# Altium schematic sheet 枪盒触摸板-20201219.SchDoc
size A3
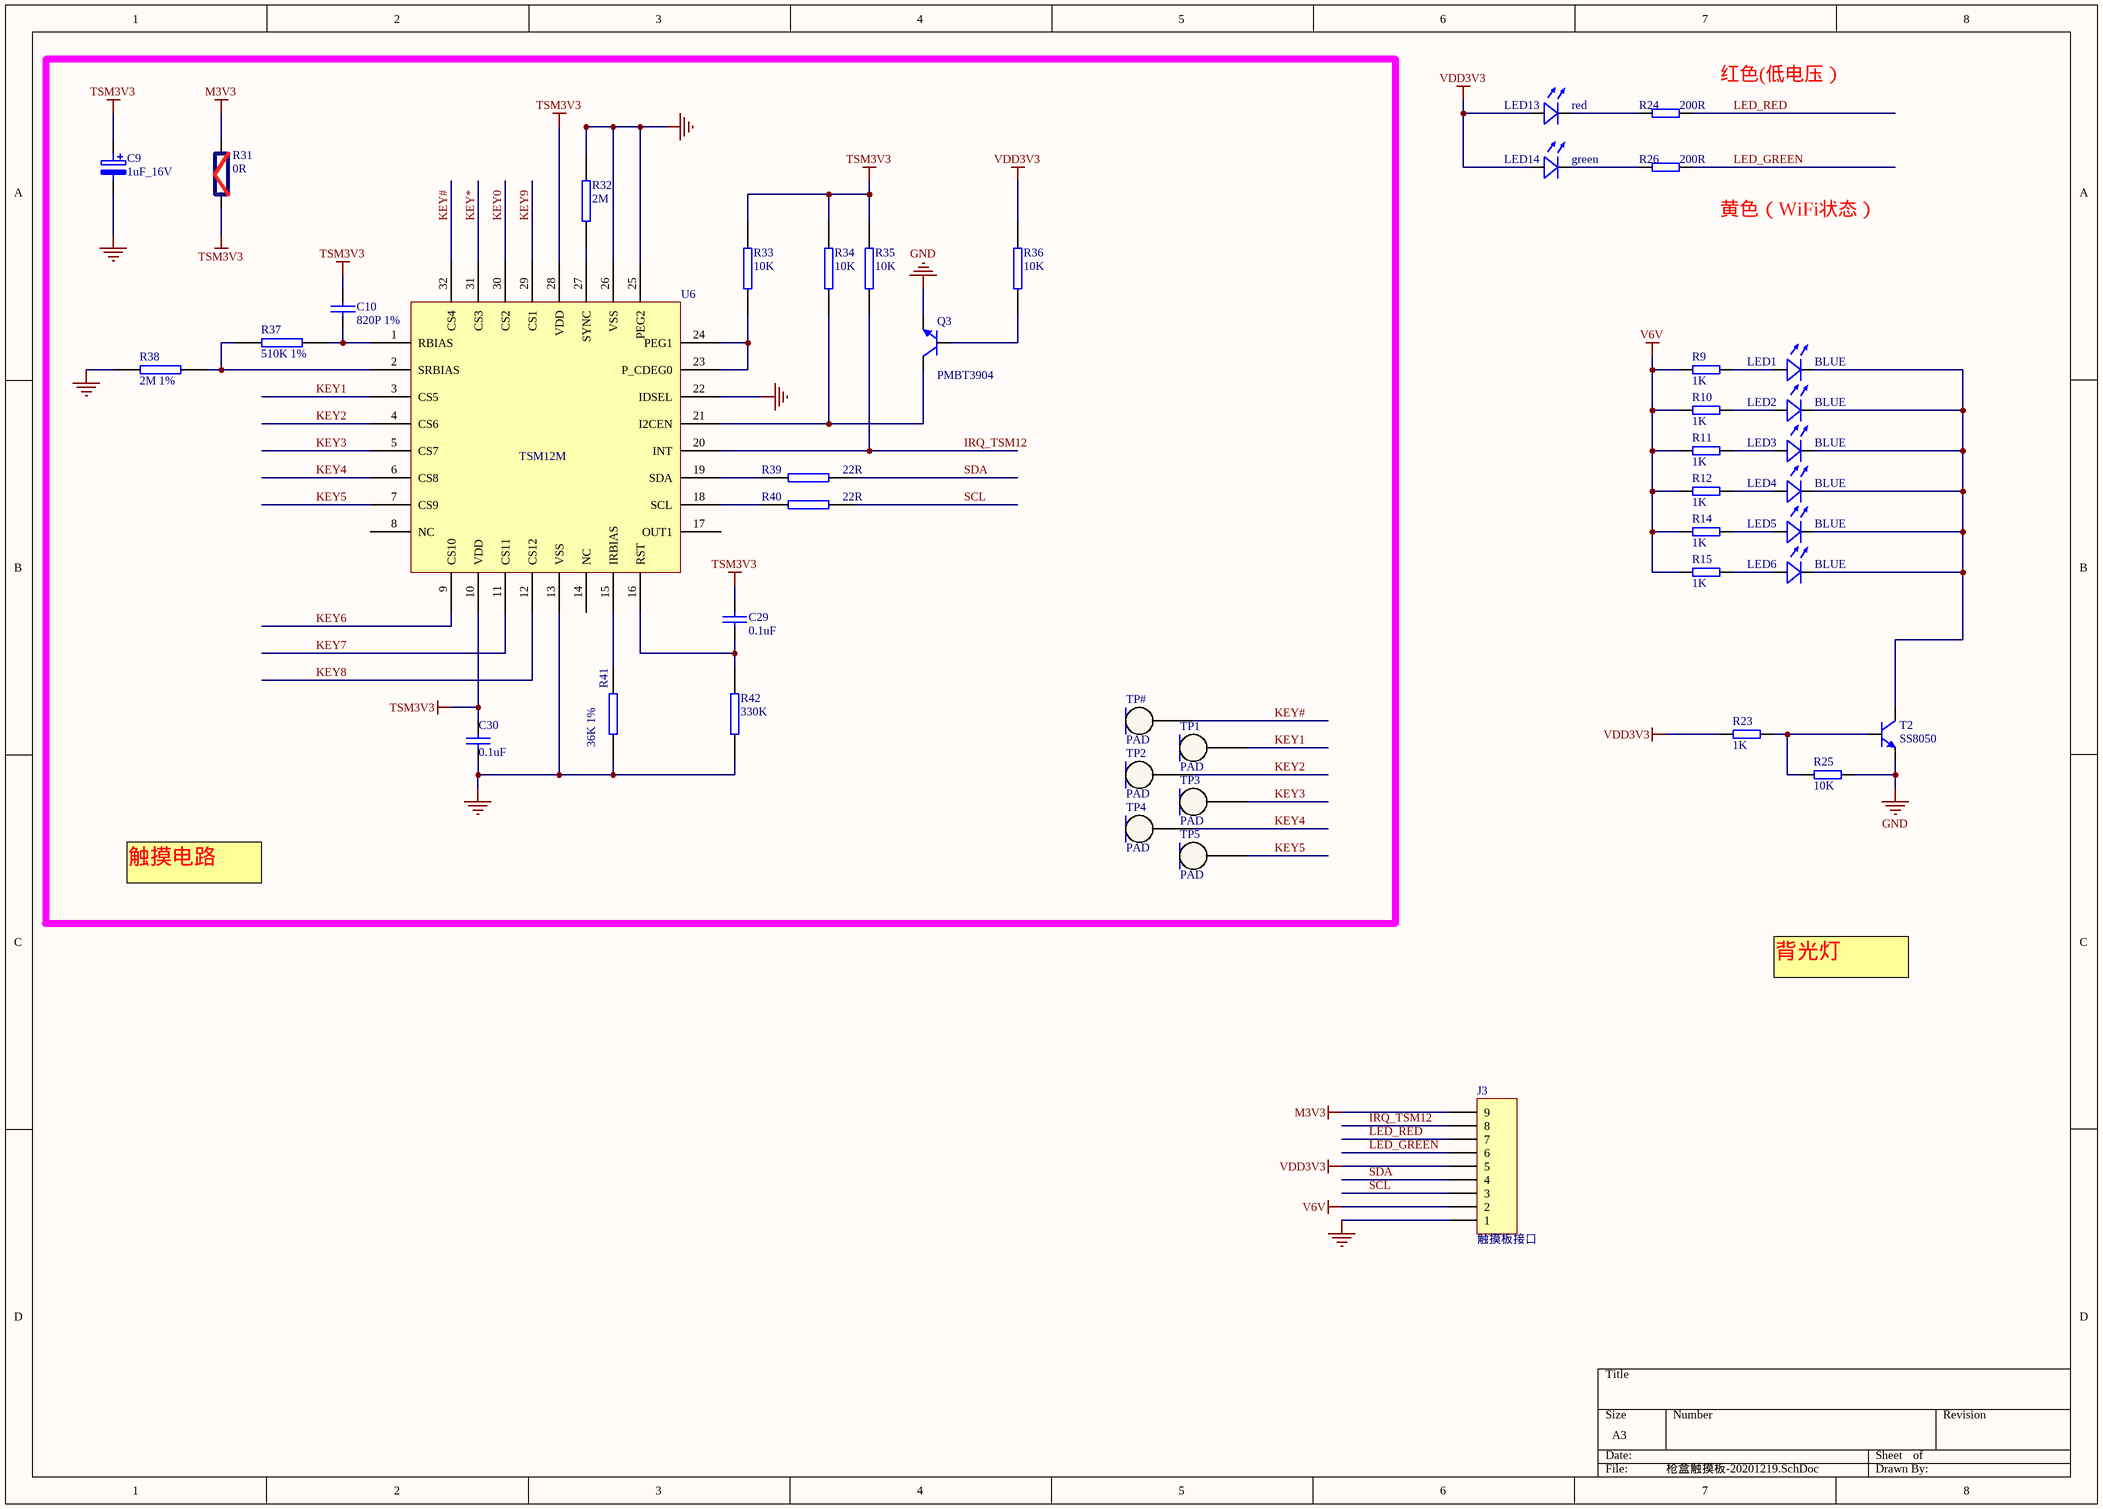
[diagram p0: 枪盒触摸板-20201219.SchDoc]

## Parts
C9  1uF_16V  [0805C]
C10  820P 1%  [0402C]
C29  0.1uF  [0402C]
C30  0.1uF  [0402C]
J3  触摸板接口  [FPC-0.5-9P]
LED1  BLUE  [0603LED]
LED2  BLUE  [0603LED]
LED3  BLUE  [0603LED]
LED4  BLUE  [0603LED]
LED5  BLUE  [0603LED]
LED6  BLUE  [0603LED]
LED13  red  [0603LED]
LED14  green  [0603LED]
Q3  PMBT3904  [SOT-23-3L]
R9  1K  [0402R]
R10  1K  [0402R]
R11  1K  [0402R]
R12  1K  [0402R]
R14  1K  [0402R]
R15  1K  [0402R]
R23  1K  [0402R]
R24  200R  [0402R]
R25  10K  [0402R]
R26  200R  [0402R]
R31  0R  [0603R]
R32  2M  [0402R]
R33  10K  [0402R]
R34  10K  [0402R]
R35  10K  [0402R]
R36  10K  [0402R]
R37  510K 1%  [0402R]
R38  2M 1%  [0402R]
R39  22R  [0402R]
R40  22R  [0402R]
R41  36K 1%  [0402R]
R42  330K  [0402R]
T2  SS8050  [SOT-23-3L]
TP1  PAD  [TH]
TP2  PAD  [TH]
TP3  PAD  [TH]
TP4  PAD  [TH]
TP5  PAD  [TH]
TP#  PAD  [TH]
U6  TSM12M  [ADS_TMS12]

## Nets
GND: C9.2 C30.1 J3.1 Q3.2 R25.1 R32.2 R38.1 R41.1 R42.1 T2.2 U6.13(VSS) U6.22(IDSEL) U6.25(PEG2) U6.26(VSS)
M3V3: J3.9 R31.2
TSM3V3: C9.1 C10.2 C29.2 C30.2 R31.1 R33.2 R34.2 R35.2 U6.10(VDD) U6.28(VDD)
V6V: J3.2 R9.1 R10.1 R11.1 R12.1 R14.1 R15.1
VDD3V3: J3.5 LED13.1 LED14.1 R23.1 R36.2
IRQ_TSM12: J3.8 R35.1 U6.20(INT)
KEY0: U6.30(CS2)
KEY1: TP1.1 U6.3(CS5)
KEY2: TP2.1 U6.4(CS6)
KEY3: TP3.1 U6.5(CS7)
KEY4: TP4.1 U6.6(CS8)
KEY5: TP5.1 U6.7(CS9)
KEY6: U6.9(CS10)
KEY7: U6.11(CS11)
KEY8: U6.12(CS12)
KEY9: U6.29(CS1)
KEY#: TP#.1 U6.32(CS4)
KEY*: U6.31(CS3)
LED_GREEN: J3.6 R26.2
LED_RED: J3.7 R24.2
SCL: J3.3 R40.1
SDA: J3.4 R39.1
NetC10_1: C10.1 R37.2 U6.1(RBIAS)
NetC29_1: C29.1 R42.2 U6.16(RST)
NetLED1_1: LED1.1(A) R9.2
NetLED1_2: LED1.2(K) LED2.2(K) LED3.2(K) LED4.2(K) LED5.2(K) LED6.2(K) T2.3
NetLED2_1: LED2.1(A) R10.2
NetLED3_1: LED3.1(A) R11.2
NetLED4_1: LED4.1(A) R12.2
NetLED5_1: LED5.1(A) R14.2
NetLED6_1: LED6.1(A) R15.2
NetLED13_2: LED13.2 R24.1
NetLED14_2: LED14.2 R26.1
NetQ3_1: Q3.1 R36.1
NetQ3_3: Q3.3 R34.1 U6.21(I2CEN)
NetR23_2: R23.2 R25.2 T2.1
NetR32_1: R32.1 U6.27(SYNC)
NetR33_1: R33.1 U6.23(P_CDEG0) U6.24(PEG1)
NetR37_1: R37.1 R38.2 U6.2(SRBIAS)
NetR39_2: R39.2 U6.19(SDA)
NetR40_2: R40.2 U6.18(SCL)
NetR41_2: R41.2 U6.15(IRBIAS)

Not connected (* = marked no-connect by the designer): U6 8(NC) 14(NC) 17(OUT1)

## Notes on the sheet
- (near R24) 红色(低电压）
- (near R26) 黄色（WiFi状态）
- 触摸电路
- 背光灯

## Library data of the parts
C9 = C-C?: Electrolytic Capacitor
C10 C29 C30 = CAP: Capacitor
J3 = Header 9: Header,9-Pin; LatestRevisionDate: 17-Jul-2002; LatestRevisionNote: Re-released for DXP Platform.; Publisher: Altium Limited
LED1-LED6 LED13 LED14 = LED
Q3 T2 = NPN_BJT: Bipolar Junction Transistor
R9-R12 R14 R15 R23-R26 = R
R31 = POWER-R
R32-R42 = RES2
TP1-TP5 TP# = TestPoint: Test Point